# Altium project My主板_V5.PrjPcb
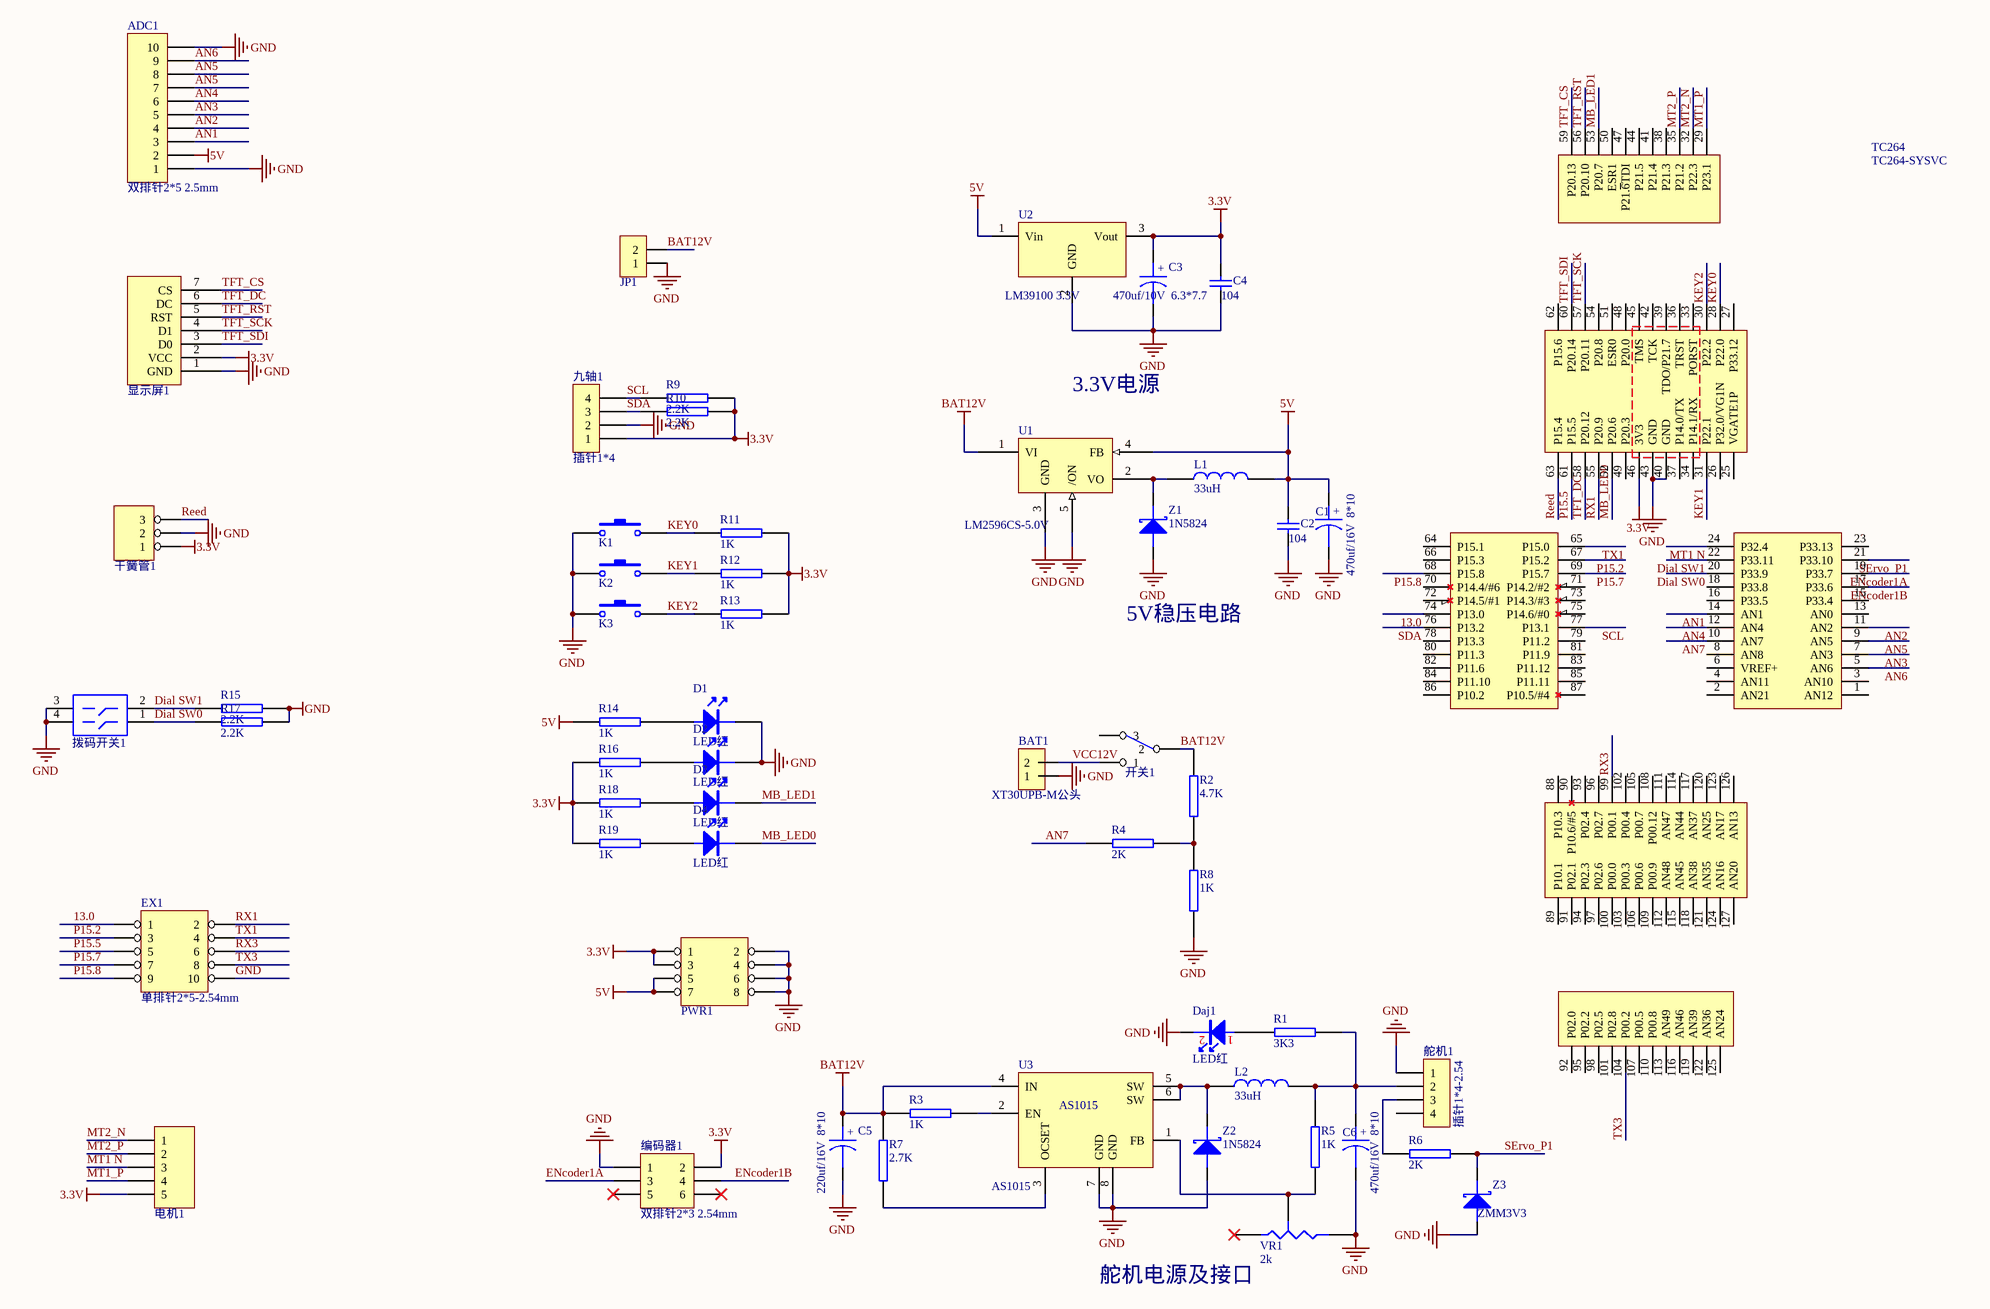
[diagram p0: My主板_V5.SchDoc]
1 sheet, 56 parts. Net scope: global (net labels, ports and power ports of the same name join across sheets).
Board file: My主板_V5.PcbDoc

## Sheet My主板_V5.SchDoc
size A1

### Parts
ADC1  双排针2*5 2.5mm  [LQ_IDC5X2]
BAT1  XT30UPB-M公头  [LQ_XT30UPB-F]
C1  470uf/16V  8*10  [LQ_C6d3X7d7]
C2  value 104  [LQ_C0603]  (hidden comment: 104nF)
C3  470uf/10V  6.3*7.7  [LQ_C6d3X7d7]
C4  value 104  [LQ_C0603]  (hidden comment: 104nF)
C5  220uf/16V  8*10  [LQ_C6d3X7d7]
C6  470uf/16V  8*10  [LQ_C6d3X7d7]
D1  LED红  [LQ_LED0603R]
D2  LED红  [LQ_LED0603R]
D3  LED红  [LQ_LED0603R]
D4  LED红  [LQ_LED0603R]
Daj1  LED红  [LQ_LED0603R]
EX1  单排针2*5-2.54mm  [LQ_IDC5X2]
JP1  HDR-1X2  [KF301-5.0-2P]  (value not drawn)
K1  微动开关6*6*6  [LQ_BT4SMT]  (value not drawn)
K2  微动开关6*6*6  [LQ_BT4SMT]  (value not drawn)
K3  微动开关6*6*6  [LQ_BT4SMT]  (value not drawn)
L1  33uH  [LQ_L7X7]
L2  33uH  [LQ_L7X7]
PWR1  双排针4X2-2.54  [LQ_IDC4X2]  (value not drawn)
R1  3K3  [LQ_R0603]
R2  4.7K  [LQ_R0603]
R3  1K  [LQ_R0603]
R4  2K  [LQ_R0603]
R5  1K  [LQ_R0603]
R6  2K  [LQ_R0603]
R7  2.7K  [LQ_R0603]
R8  1K  [LQ_R0603]
R9  2.2K  [LQ_R0603]
R10  2.2K  [LQ_R0603]
R11  1K  [LQ_R0603]
R12  1K  [LQ_R0603]
R13  1K  [LQ_R0603]
R14  1K  [LQ_R0603]
R15  2.2K  [LQ_R0603]
R16  1K  [LQ_R0603]
R17  2.2K  [LQ_R0603]
R18  1K  [LQ_R0603]
R19  1K  [LQ_R0603]
TC264  TC264-SYSVC  [LQ-TC264-SYSVC-S]
U1  LM2596CS-5.0V  [LQ_TO-263-5]
U2  LM39100 3.3V  [SOT223_M]
U3  AS1015  [SOP8]
VR1  2k  [lq_3266]
Z1  1N5824  [LQ_1206D]
Z2  1N5824  [LQ_1206D]
Z3  ZMM3V3  [LQ_1206D]
九轴1  插针1*4  [LQ_XH254-4P]
干簧管1  XH254-3P  [LQ_XH254-3P]  (value not drawn)
开关1  KCD1-101 117S  [LQ_KCD1-101 117S]  (value not drawn)
拨码开关1  SW-DIP2  [DIP4]  (value not drawn)
显示屏1  单排座1*7-2.54  [LQ-TFT-180V33]  (value not drawn)
电机1  XH254-4P  [LQ_XH254-5P]  (value not drawn)
编码器1  双排针2*3 2.54mm  [LQ_ENCODER]
舵机1  插针1*4-2.54  [LQ_XH254-4P]

### Nets
3.3V: C3.1 C4.2 PWR1.1 PWR1.3 R9.1 R10.2 R11.2 R12.2 R13.2 R16.1 R18.1 R19.1 TC264.46(3V3) U2.3(Vout) 九轴1.1 干簧管1.1 显示屏1.2(VCC) 电机1.5 编码器1.2
5V: ADC1.2 C1.1 C2.1 L1.2 PWR1.5 PWR1.7 R14.1 U1.4(FB) U2.1(Vin)
BAT12V: C5.1 JP1.2 R2.1 R3.2 R7.1 U1.1(VI) U3.4(IN) 开关1.2
GND: ADC1.1 ADC1.10 BAT1.1 C1.2 C2.2 C3.2 C4.1 C5.2 C6.2 D1.2 D2.2 Daj1.2 EX1.10 JP1.1 K1.1 K2.1 K3.1 PWR1.2 PWR1.4 PWR1.6 PWR1.8 R8.2 R15.2 R17.2 TC264.40(GND) TC264.43(GND) U1.3(GND) U1.5(/ON) U2.2(GND) U3.7(GND) U3.8(GND) VR1.2(B) Z1.1 Z2.1 Z3.1 九轴1.2 干簧管1.2 拨码开关1.3 拨码开关1.4 显示屏1.1(GND) 编码器1.1 舵机1.1
13.0: EX1.1 TC264.74(P13.0)
AN1: ADC1.3 TC264.14(AN1)
AN2: ADC1.4 TC264.11(AN2)
AN3: ADC1.5 TC264.7(AN3)
AN4: ADC1.6 TC264.12(AN4)
AN5: ADC1.7 ADC1.8 TC264.9(AN5)
AN6: ADC1.9 TC264.5(AN6)
AN7: R4.1 TC264.10(AN7)
Dial SW0: R17.1 TC264.20(P33.9) 拨码开关1.1
Dial SW1: R15.1 TC264.22(P33.11) 拨码开关1.2
ENcoder1A: TC264.19(P33.7) 编码器1.3
ENcoder1B: TC264.17(P33.6) 编码器1.4
KEY0: K1.2 R11.1 TC264.28(P22.0)
KEY1: K2.2 R12.1 TC264.31(P22.1)
KEY2: K3.2 R13.1 TC264.30(P22.2)
MB_LED0: D4.2 TC264.52(P20.6)
MB_LED1: D3.2 TC264.53(P20.7)
MT1 N: TC264.24(P32.4) 电机1.3
MT1_P: TC264.29(P23.1) 电机1.4
MT2_N: TC264.32(P22.3) 电机1.1
MT2_P: TC264.35(P21.2) 电机1.2
P15.2: EX1.3 TC264.67(P15.2)
P15.5: EX1.5 TC264.61(P15.5)
P15.7: EX1.7 TC264.69(P15.7)
P15.8: EX1.9 TC264.68(P15.8)
Reed: TC264.63(P15.4) 干簧管1.3
RX1: EX1.2 TC264.55(P20.9)
RX3: EX1.6 TC264.99(P00.1)
SCL: R9.2 TC264.77(P13.1) 九轴1.4
SDA: R10.1 TC264.76(P13.2) 九轴1.3
SErvo_P1: R6.1 TC264.21(P33.10) Z3.2
TFT_CS: TC264.59(P20.13) 显示屏1.7(CS)
TFT_DC: TC264.58(P20.12) 显示屏1.6(DC)
TFT_RST: TC264.56(P20.10) 显示屏1.5(RST)
TFT_SCK: TC264.57(P20.11) 显示屏1.4(D1)
TFT_SDI: TC264.60(P20.14) 显示屏1.3(D0)
TX1: EX1.4 TC264.65(P15.0)
TX3: EX1.8 TC264.104(P00.2)
VCC12V: BAT1.2 开关1.1
NetC6_1: C6.1 L2.2 R1.2 R5.2 舵机1.2
NetD1_1: D1.1 R14.2
NetD2_1: D2.1 R16.2
NetD3_1: D3.1 R18.2
NetD4_1: D4.1 R19.2
NetDaj1_1: Daj1.1 R1.1
NetL1_1: L1.1 U1.2(VO) Z1.2
NetL2_1: L2.1 U3.5(SW) U3.6(SW) Z2.2
NetR2_2: R2.2 R4.2 R8.1
NetR3_1: R3.1 U3.2(EN)
NetR5_1: R5.1 U3.1(FB) VR1.3(TAP)
NetR6_2: R6.2 舵机1.3
NetR7_2: R7.2 U3.3(OCSET)

Not connected (* = marked no-connect by the designer): TC264 1(AN12) 2(AN21) 3(AN10) 4(AN11) 6(VREF+) 8(AN8) 13(AN0) 15(P33.4) 16(P33.5) 18(P33.8) 23(P33.13) 25(VGATE1P) 26(P32.0/VG1N) 27(P33.12) 33(PORST) 34(P14.1/RX) 36(TRST) 37(P14.0/TX) 38(P21.3) 39(TDO/P21.7) 41(P21.4) 42(TCK) 44(P21.5) 45(TMS) 47(P21.~{6}TDI) 48(P20.0) 49(P20.3) 50(ESR1) 51(ESR0) 54(P20.8) 62(P15.6) 64(P15.1) 66(P15.3) 70(P14.4/#6) 71(P14.2/#2) 72(P14.5/#1) 73(P14.3/#3) 75(P14.6/#0) 78(P13.3) 79(P11.2) 80(P11.3) 81(P11.9) 82(P11.6) 83(P11.12) 84(P11.10) 85(P11.11) 86(P10.2) 87(P10.5/#4) 88(P10.3) 89(P10.1) 90(P10.6/#5) 91(P02.1) 92(P02.0) 93(P02.4) 94(P02.3) 95(P02.2) 96(P02.7) 97(P02.6) 98(P02.5) 100(P00.0) 101(P02.8) 102(P00.4) 103(P00.3) 105(P00.7) 106(P00.6) 107(P00.5) 108(P00.12) 109(P00.9) 110(P00.8) 111(AN47) 112(AN48) 113(AN49) 114(AN44) 115(AN45) 116(AN46) 117(AN37) 118(AN38) 119(AN39) 120(AN25) 121(AN35) 122(AN36) 123(AN17) 124(AN16) 125(AN24) 126(AN13) 127(AN20); VR1 1(A)*; 开关1 3; 编码器1 5* 6*; 舵机1 4

### Notes on the sheet
- 3.3V电源
- 5V稳压电路
- 舵机电源及接口
- (in symbol CAPACITOR POL) +

### Library data of the parts
ADC1 = CON10: Connector
BAT1 = LQ_PIN2: Jumper
C1 C3 C5 C6 = CAPACITOR POL: Capacitor
C2 C4 = Cap: Capacitor; Published: 8-Jun-2000; LatestRevisionDate: 17-Jul-2002; LatestRevisionNote: Re-released for DXP Platform.; PackageReference: RAD-0.3; Publisher: Altium Limited; PackageDescription: Radial Cap, Thru-Hole; 2 Leads; 0.3 in Pin Spacing
D1-D4 = LED
Daj1 = LQ_LED
EX1 = HEADER 5X2
JP1 = Header 2_1: 2P接插件; 版权归属: 源创客; BOM名称: 2P接插件; 学习资源: www.ooocke.com
K1-K3 = 微动开关
L1 L2 = INDUCTOR
PWR1 = HEADER 4X2
R1-R19 = RES2
TC264 = LQ-TC264-SYSVC
U1 = LM2575T
U2 = VOLTREG
VR1 = RESISTOR TAPPED
Z1-Z3 = LQ_D: Schottky Diode
九轴1 舵机1 = CON4: Connector
干簧管1 = HEADER 3
开关1 = LQ_SWMTS102
显示屏1 = LQ_OLED128X64
电机1 = Header 5: Header, 5-Pin; LatestRevisionDate: 17-Jul-2002; LatestRevisionNote: Re-released for DXP Platform.; Publisher: Altium Limited
编码器1 = Header 3X2: Header, 3-Pin, Dual row; LatestRevisionDate: 17-Jul-2002; LatestRevisionNote: Re-released for DXP Platform.; Publisher: Altium Limited